# EAGLE schematic attiny85_LED (EAGLE 9.3.1)
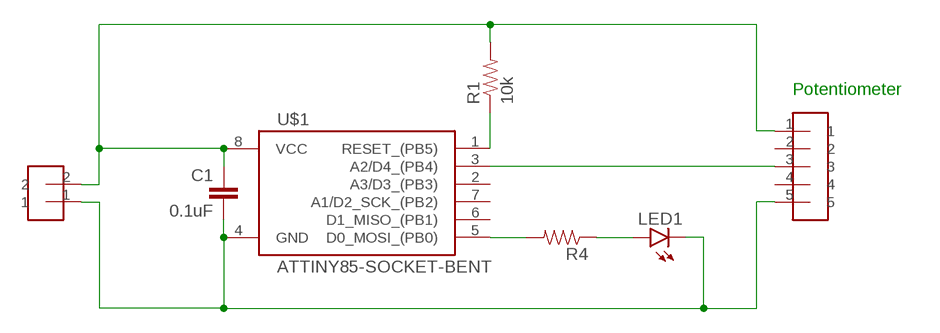
[diagram p0: schematic, sheet 1]

## Parts
C1  0.1uF  CAP-0805  [0805]
LED1  LED0603  [LED-0603]
POTENTIOMETER  HEADER-5  [HEADER-5]
R1  10k  RESISTOR-0805  [0805]
R4  RESISTOR0603  [0603-RES]
U$1  ATTINY85-SOCKET-BENT  [SOCKET-8PIN-BENT]
U$3  HEADER-2  [HEADER-2]

## Nets
5V: C1.1 POTENTIOMETER.1 R1.2 U$1.8(VCC) U$3.2
GND: C1.2 LED1.C POTENTIOMETER.5 U$1.4(GND) U$3.1
N$1: LED1.A R4.1
N$3: R4.2 U$1.5(D0_MOSI_(PB0))
RESET: R1.1 U$1.1(RESET_(PB5))
SENSOR: POTENTIOMETER.3 U$1.3(A2/D4_(PB4))
Unconnected: POTENTIOMETER.2 POTENTIOMETER.4 U$1.2(A3/D3_(PB3)) U$1.6(D1_MISO_(PB1)) U$1.7(A1/D2_SCK_(PB2))

## Notes on the sheet
- Potentiometer

## Library data of the parts
C1 = homemade-hardware:CAP: Capacitor Standard 0603 ceramic capacitor, and 0.1" leaded capacitor.
LED1 = homemade-hardware:LED: LEDs Standard schematic elements and footprints for 5mm, 3mm, 1206, and 0603 sized LEDs. 5mm - Spark Fun Electronics SKU : COM-00529 (and others)
POTENTIOMETER = homemade-hardware:HEADER-5
R1 R4 = homemade-hardware:RESISTOR: Resistor Basic schematic elements and footprints for 0603, 1206, and PTH resistors.
U$1 = homemade-hardware:ATTINY85
U$3 = homemade-hardware:HEADER-2